# Altium project DuAn_HighVoltage_V3.PrjPcb (part 2 of 2)
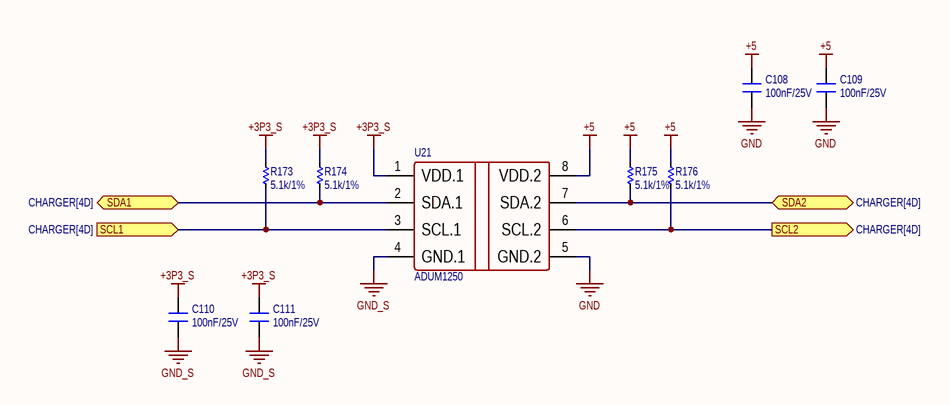
[diagram p20: I2C_ISO.SchDoc]

## Nets that join several sheets
+3P3_S: MAIN (13 pins), RS232 (C68.2 C141.2 U9.1 U25.1), FLYBACK_300V (5 pins), FLYBACK_300V/TEMPERATURE_SENSOR (C74A.2 U11A.1), FLYBACK_50V (5 pins), FLYBACK_50V/TEMPERATURE_SENSOR (C74B.2 U11B.1), SECONDARY_POWER (C64.2 C65.2 U7.2,4), ACCELEROMETER (15 pins), ANALOG (C81.1 C84.1 U14.5 U15.5), OVP (6 pins), XBEE (C105.2 C106.2 R170.1 U20.1), POWER_CON (JP5.3), COMUNICATE_CON (J8.1), PERIPHERAL_CON (R196.1 R197.1 R198.1 R199.1), I2C_ISO (5 pins)
+5: USB_ISOLATE (9 pins), RS232 (8 pins), EXTERNAL_FAN1 (R26A.1), EXTERNAL_FAN2 (R26B.1), PRIMARY_POWER (8 pins), COMUNICATE_CON (JP8.3), CHARGER (5 pins), I2C_ISO (5 pins)
+5_S: USB_ISOLATE (6 pins), SECONDARY_POWER (8 pins), POWER_CON (JP5.2), COMUNICATE_CON (JP8.1)
+12_S: FLYBACK_300V (C3A.2 C4A.2 U1A.16), FLYBACK_50V (C3B.2 C4B.2 U1B.16), SECONDARY_POWER (8 pins), POWER_CON (JP5.1)
+50_S: FLYBACK_50V (D1B.2), CAPACITOR (C23.1 C24.1 R14.1 R15.1), ANALOG (R55.1), CAP_RELEASE (R77.1 R78.1), POWER_CON (6 pins)
+300_S: FLYBACK_300V (D1A.2), CAPACITOR (12 pins), ANALOG (R50.1), CAP_RELEASE (R71.1), POWER_CON (6 pins)
+V_STANDBY: INPUT_PROTECTION (6 pins), CHARGER (9 pins)
+V_SYS: EXTERNAL_FAN1 (C66A.1 J3A.1), EXTERNAL_FAN2 (C66B.1 J3B.1), FLYBACK_300V (11 pins), FLYBACK_50V (11 pins), INPUT_PROTECTION (6 pins), SECONDARY_POWER (5 pins), PRIMARY_POWER (15 pins)
GND: USB_ISOLATE (7 pins), RS232 (10 pins), EXTERNAL_FAN1 (Q5A.3 R28A.1), EXTERNAL_FAN2 (Q5B.3 R28B.1), FLYBACK_300V (7 pins), FLYBACK_50V (7 pins), INPUT_PROTECTION (7 pins), SECONDARY_POWER (6 pins), PRIMARY_POWER (25 pins), COMUNICATE_CON (JP8.4), CHARGER (21 pins), I2C_ISO (C108.2 C109.2 U21.5)
GND_S: USB_ISOLATE (C135.2 C138.2 U24.2 U24.8), MAIN (16 pins), RS232 (C68.1 C141.1 U9.4 U25.4), EXTERNAL_FAN1 (U8A.K), EXTERNAL_FAN2 (U8B.K), FLYBACK_300V (12 pins), FLYBACK_300V/TEMPERATURE_SENSOR (C74A.1 C75A.1 U11A.3), FLYBACK_50V (12 pins), FLYBACK_50V/TEMPERATURE_SENSOR (C74B.1 C75B.1 U11B.3), CAPACITOR (12 pins), SECONDARY_POWER (17 pins), ACCELEROMETER (9 pins), ANALOG (10 pins), OVP (10 pins), XBEE (5 pins), POWER_CON (15 pins), COMUNICATE_CON (6 pins), PERIPHERAL_CON (J12.2 J12.4 J14.2 J14.4), I2C_ISO (C110.2 C111.2 U21.4)
50V_FB_MCU: MAIN (U13.8), ANALOG (C86.1 R57.1)
300V_FB_MCU: MAIN (U13.10), ANALOG (C83.1 R53.1)
CALL_HV: MAIN (U13.4), COMUNICATE_CON (JP8.6)
CHAR_SCL: MAIN (U13.29), I2C_ISO (R173.2 U21.3)
CHAR_SDA: MAIN (U13.30), I2C_ISO (R174.2 U21.2)
DEBUG_RX: MAIN (U13.59), COMUNICATE_CON (R178.2)
DEBUG_TX: MAIN (U13.58), COMUNICATE_CON (R177.2)
FAN_PWM1: MAIN (U13.16), EXTERNAL_FAN1 (R27A.1)
FAN_PWM2: MAIN (U13.17), EXTERNAL_FAN2 (R27B.1)
LED1: MAIN (U13.14), PERIPHERAL_CON (R84.1)
LED2: MAIN (U13.15), PERIPHERAL_CON (R85.1)
MCU_CAP_DISCHARGE_1: MAIN (U13.43), FLYBACK_300V (R3A.2)
MCU_CAP_DISCHARGE_2: MAIN (U13.56), FLYBACK_50V (R3B.2)
MCU_FLYBACK_SD_1: MAIN (U13.42), FLYBACK_300V (R5A.2)
MCU_FLYBACK_SD_2: MAIN (U13.51), FLYBACK_50V (R5B.2)
MCU_FLYBACK_SW_1: MAIN (U13.44), FLYBACK_300V (R1A.2)
MCU_FLYBACK_SW_2: MAIN (U13.57), FLYBACK_50V (R1B.2)
MCU_FLYBACK_TEMP_1: MAIN (U13.24), FLYBACK_300V/TEMPERATURE_SENSOR (C75A.2 R35A.1)
MCU_FLYBACK_TEMP_2: MAIN (U13.25), FLYBACK_50V/TEMPERATURE_SENSOR (C75B.2 R35B.1)
NetQ2A_2: FLYBACK_300V (Q2A.2), CAP_RELEASE (R76.2)
NetQ2B_2: FLYBACK_50V (Q2B.2), CAP_RELEASE (R77.2 R78.2)
NetR53_2: ANALOG (R53.2 U14.1 U14.4), OVP (R60.2)
NetR57_2: ANALOG (R57.2 U15.1 U15.4), OVP (R65.2)
NetR175_2: CHARGER (U23.4), I2C_ISO (R175.2 U21.7)
NetR176_2: CHARGER (U23.3), I2C_ISO (R176.2 U21.6)
ONBOARD_SEN_INT_1: MAIN (U13.28), ACCELEROMETER (R44.2)
ONBOARD_SEN_INT_2: MAIN (U13.26), ACCELEROMETER (R45.2)
ONBOARD_SEN_SCL: MAIN (U13.41), ACCELEROMETER (R42.2)
ONBOARD_SEN_SDA: MAIN (U13.40), ACCELEROMETER (R43.2)
OVP_MCU_50: MAIN (U13.9), OVP (R66.1 U17.1)
OVP_MCU_300: MAIN (U13.11), OVP (R61.1 U16.1)
PERIPH_PUSH_BUTTON: MAIN (U13.34), PERIPHERAL_CON (R200.1)
PERIPH_PUSH_LED: MAIN (U13.35), PERIPHERAL_CON (R203.1)
RS232_RX1: RS232 (R29.2), COMUNICATE_CON (JP6.9)
RS232_RX2: RS232 (R90.2), COMUNICATE_CON (JP6.7)
RS232_TX1: RS232 (R32.2), COMUNICATE_CON (JP6.2)
RS232_TX2: RS232 (R91.2), COMUNICATE_CON (JP6.4)
SENSOR_INT_1: MAIN (U13.20), PERIPHERAL_CON (R201.1)
SENSOR_INT_2: MAIN (U13.21), PERIPHERAL_CON (R202.1)
SENSOR_INT_3: MAIN (U13.22), PERIPHERAL_CON (R204.1)
SENSOR_INT_4: MAIN (U13.23), PERIPHERAL_CON (R205.1)
SENSOR_SCL: MAIN (U13.61), ACCELEROMETER (R49.2)
SENSOR_SDA: MAIN (U13.62), ACCELEROMETER (R48.2)
SLAVE_RX: MAIN (U13.38), COMUNICATE_CON (JP6.6)
SLAVE_TX: MAIN (U13.37), COMUNICATE_CON (JP6.5)
SWCLK: MAIN (U13.49), COMUNICATE_CON (R180.2)
SWDIO: MAIN (U13.46), COMUNICATE_CON (R179.2)
XBEE_RX: XBEE (R171.2), COMUNICATE_CON (JP6.10)
XBEE_TX: XBEE (R169.2), COMUNICATE_CON (JP6.1)

## Assembly variants
Variant of DuAn_HighVoltage_V3: all parts fitted